# EAGLE design untitled (EAGLE 7.7.0)
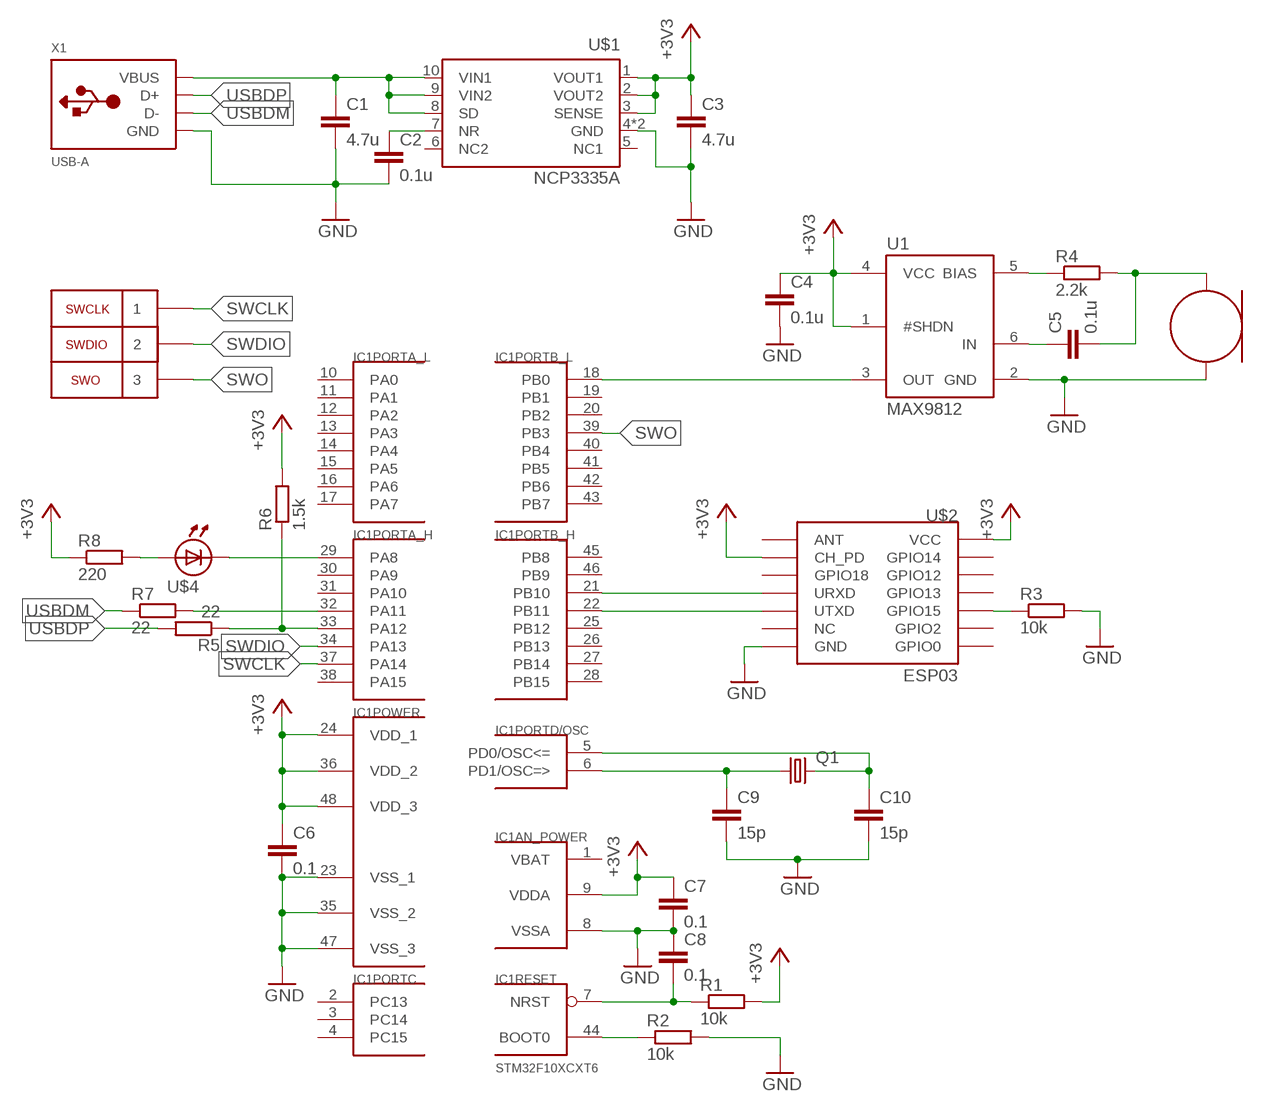
[diagram p0: schematic, sheet 1]

## Parts
C1  4.7u  C-EUC0805  [C0805]
C2  0.1u  C-EUC0805  [C0805]
C3  4.7u  C-EUC0805  [C0805]
C4  0.1u  C-EUC0603  [C0603]
C5  0.1u  C-EUC0603  [C0603]
C6  0.1  C-EUC0805  [C0805]
C7  0.1  C-EUC0805  [C0805]
C8  0.1  C-EUC0805  [C0805]
C9  15p  C-EUC0603  [C0603]
C10  15p  C-EUC0603  [C0603]
IC1  STM32F10XCXT6  [TQFP48]
Q1  CRYSTAL  [DSX321G]
R1  10k  R-EU_R0805  [R0805]
R2  10k  R-EU_R0805  [R0805]
R3  10k  R-EU_R0805  [R0805]
R4  2.2k  R-EU_R0603  [R0603]
R5  22  R-EU_R0805  [R0805]
R6  1.5k  R-EU_R0805  [R0805]
R7  22  R-EU_R0805  [R0805]
R8  220  R-EU_R0805  [R0805]
U1  MAX9812  [SC-70-6]
U$1  NCP3335A  [DFN10-3X3]
U$2  ESP03  [ESP03]
U$3  MIC  [MIC]
U$4  LED1206  [R1206]
U$5  PLS2-3  [PLS2-3]
X1  USB-A  [MOLEX_480371000]

## Nets
+3V3: C3.1 C4.1 C6.1 C7.1 IC1.9(AN_POWER:VDDA) IC1.24(POWER:VDD_1) IC1.36(POWER:VDD_2) IC1.48(POWER:VDD_3) R1.2 R6.2 R8.1 U1.1(#SHDN) U1.4(VCC) U$1.1(VOUT1) U$1.2(VOUT2) U$1.3(SENSE) U$2.CH_PD U$2.VCC
GND: C1.2 C2.2 C3.2 C4.2 C6.2 C7.2 C8.1 C9.2 C10.2 IC1.8(AN_POWER:VSSA) IC1.23(POWER:VSS_1) IC1.35(POWER:VSS_2) IC1.47(POWER:VSS_3) R2.2 R3.2 U1.2(GND) U$1.4(GND) U$1.EXP(GND) U$2.GND U$3.P$2 X1.4(GND)
N$1: C1.1 U$1.8(SD) U$1.9(VIN2) U$1.10(VIN1) X1.1(VBUS)
N$2: C2.1 U$1.7(NR)
N$3: C8.2 IC1.7(RESET:NRST) R1.1
N$4: IC1.44(RESET:BOOT0) R2.1
N$5: IC1.21(PORTB_H:PB10) U$2.URXD
N$6: IC1.22(PORTB_H:PB11) U$2.UTXD
N$7: R3.1 U$2.GPIO15
N$8: IC1.18(PORTB_L:PB0) U1.3(OUT)
N$9: R4.1 U1.5(BIAS)
N$10: C5.1 U1.6(IN)
N$11: C5.2 R4.2 U$3.P$1
N$12: IC1.33(PORTA_H:PA12) R5.1 R6.1
N$13: IC1.32(PORTA_H:PA11) R7.2
N$14: C9.1 IC1.6(PORTD/OSC:PD1/OSC=>) Q1.P$1
N$15: C10.1 IC1.5(PORTD/OSC:PD0/OSC<=) Q1.P$3
N$16: R8.2 U$4.1
N$17: IC1.29(PORTA_H:PA8) U$4.2
SWCLK: IC1.37(PORTA_H:PA14) U$5.P$1
SWDIO: IC1.34(PORTA_H:PA13) U$5.P$2
SWO: IC1.39(PORTB_L:PB3) U$5.P$3
USBDM: R7.1 X1.2(D-)
USBDP: R5.2 X1.3(D+)
Unconnected: IC1.2(PORTC:PC13) IC1.3(PORTC:PC14) IC1.4(PORTC:PC15) IC1.10(PORTA_L:PA0) IC1.11(PORTA_L:PA1) IC1.12(PORTA_L:PA2) IC1.13(PORTA_L:PA3) IC1.14(PORTA_L:PA4) IC1.15(PORTA_L:PA5) IC1.16(PORTA_L:PA6) IC1.17(PORTA_L:PA7) IC1.19(PORTB_L:PB1) IC1.20(PORTB_L:PB2) IC1.25(PORTB_H:PB12) IC1.26(PORTB_H:PB13) IC1.27(PORTB_H:PB14) IC1.28(PORTB_H:PB15) IC1.30(PORTA_H:PA9) IC1.31(PORTA_H:PA10) IC1.38(PORTA_H:PA15) IC1.40(PORTB_L:PB4) IC1.41(PORTB_L:PB5) IC1.42(PORTB_L:PB6) IC1.43(PORTB_L:PB7) IC1.45(PORTB_H:PB8) IC1.46(PORTB_H:PB9) U$1.5(NC1) U$1.6(NC2) U$2.ANT U$2.GPIO0 U$2.GPIO2 U$2.GPIO12 U$2.GPIO13 U$2.GPIO14 U$2.GPIO18 U$2.NC

## Power pins joined to a net without a drawn wire
VBAT: IC1.1(AN_POWER:VBAT)

## Library data of the parts
C1-C10 = rcl:C-EU: CAPACITOR, European symbol
IC1 = stm32:STM32F10XCXT6: ST STM32F101/103 48pin LQFP
Q1 = untitled:CRYSTAL: CRYSTAL
R1-R8 = rcl:R-EU_: RESISTOR, European symbol
U1 = untitled:MAX9812: Maxim's MAX9812 Tiny, Low-Cost, Single/Dual-Input, Fixed-Gain Microphone Amplifiers with Integrated Bias Description: The MAX9812/MAX9813 are single/dual-input, 20dB fixed-gain microphone amplifiers. They offer tiny packaging and a low-noise, integrated microphone bias, making them ideal for portable audio applications such as notebook computers, cell phones, and PDAs. These amplifiers feature a 500kHz bandwidth, Rail-to-Rail® outputs, an industry-leading 100dB power-supply rejection ratio, and a very low 0.015% THD+N. Power-saving features include very low 230?A supply current and a total shutdown mode that cuts the combined supply and BIAS currents to only 100nA. The MAX9812 is a single amplifier in a 6-pin SC70 package (2mm x 2.1mm) and the MAX9813 is a dualinput amplifier available in an 8-pin SOT23 (3mm x 3mm) package. The MAX9813 has two inputs allowing two microphones to be multiplexed to a single output. The MAX9812/MAX9813 are offered in two grades. The MAX9812L/MAX9813L are optimized for 3.3V supply operation (2.7V to 3.6V). The MAX9812H/MAX9813H are PC2001 compliant and are optimized for 5V operation (4.5V to 5.5V). Both devices are specified over the -40°C to +85°C extended operating temperature range. Features: PC2001 Compliant 100dB at 217Hz Power-Supply Rejection Ratio Very Low 230?A Quiescent Current Low 0.015% THD+N Available in Two Versions: - MAX9812L/MAX9813L?2.7V to 3.6V - MAX9812H/MAX9813H?4.5V to 5.5V Internal Low-Noise Microphone Bias Supply - 2.3V for MAX9812L/MAX9813L - 4.0V for MAX9812H/MAX9813H 100nA Low-Power Shutdown Mode Rail-to-Rail Outputs 20dB Fixed Gain Available in Tiny 6-Pin SC70 (2mm x 2.1mm) and 8-Pin SOT23 (3mm x 3mm) Packages Extended Temperature Range -40°C to +85°C Applications: Notebook Computers PDAs Smart Phones Car Kit Adapters Digital Cameras Video Tape Recorders Please send any comments to: messi@users.sourceforge.net
U$1 = untitled:NCP3335A
U$2 = untitled:ESP03: ESP8266 Wifi module 03; DIMENSIONS: 17.3 x 12.1 mm; PINS: 14; PITCH: 0.078" / 2 mm
U$3 = untitled:MIC
U$4 = untitled:LED1206
U$5 = untitled:PLS2-3
X1 = untitled:USB-A: USB type A 'plug' Used for things that can directly connect to a USB port, say USB key

## Board
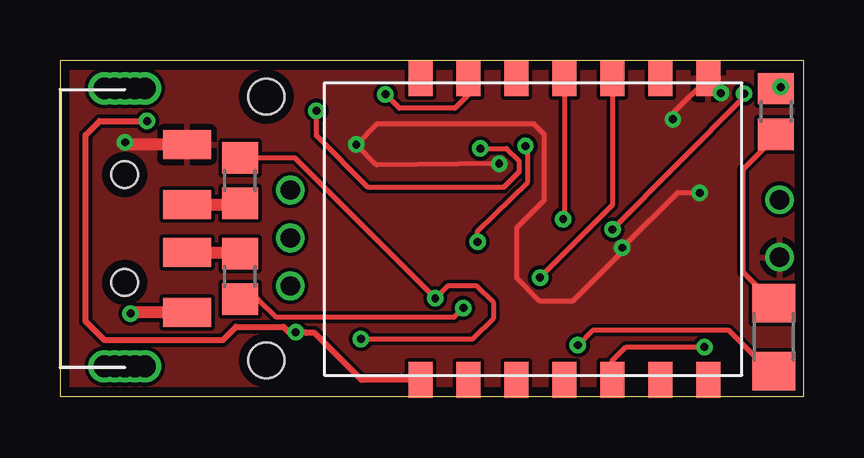
[diagram p1: board, top side]
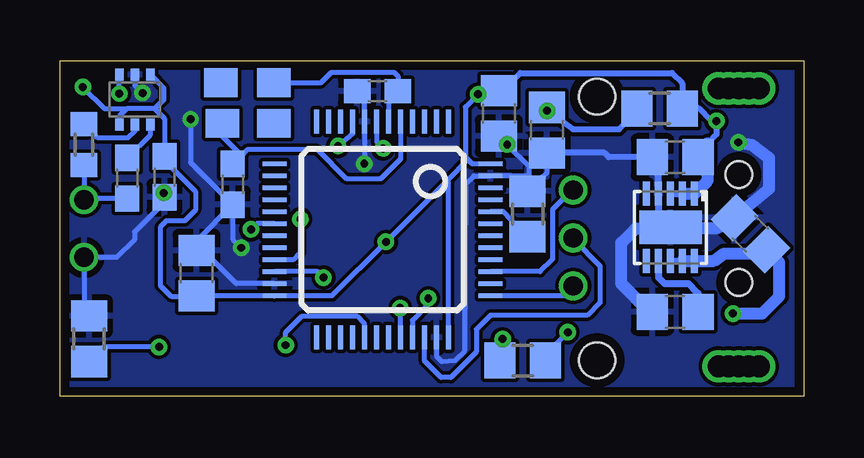
[diagram p2: board, bottom side, seen from below]

Size 31 x 14 mm. Coordinates in mm from the lower left corner, seen from the top.
Outline: 0,0 31,0 31,14 0,14 0,0
Copper layers (1*16): Top 0.0356mm / dielectric 1.5011mm / Bottom 0.0356mm
Design rules "oshpark-2layer": minimum track width 6mil, minimum drill 13mil, track to track 6mil, track to pad 6mil, pad to pad 6mil, via to via 6mil, smd to smd 6mil, copper to edge 15mil, drill to drill 6mil, minimum pad ring 7mil, minimum via ring 7mil, stop-mask expansion 2.5mil, vias tented up to drill 0mil, thermal gap 10mil
Holes 1.5 mm at 8.6,1.5 8.6,12.5

### Footprints (pad centres in the part's own frame; a part is rotated, then mirrored left to right if it is on the bottom)
C0805 = smd 1.3 x 1.5: 1 -0.95,0; 2 0.95,0
C0603 = smd 1.1 x 1: 1 -0.85,0; 2 0.85,0
TQFP48 = smd 0.2 x 1: 1 -2.75,-4.5; 2 -2.25,-4.5; 3 -1.75,-4.5; 4 -1.25,-4.5; 5 -0.75,-4.5; 6 -0.25,-4.5; 7 0.25,-4.5; 8 0.75,-4.5; 9 1.25,-4.5; 10 1.75,-4.5; 11 2.25,-4.5; 12 2.75,-4.5; 25 2.75,4.5; 26 2.25,4.5; 27 1.75,4.5; 28 1.25,4.5; 29 0.75,4.5; 30 0.25,4.5; 31 -0.25,4.5; 32 -0.75,4.5; 33 -1.25,4.5; 34 -1.75,4.5; 35 -2.25,4.5; 36 -2.75,4.5 | smd 1 x 0.2: 13 4.5,-2.75; 14 4.5,-2.25; 15 4.5,-1.75; 16 4.5,-1.25; 17 4.5,-0.75; 18 4.5,-0.25; 19 4.5,0.25; 20 4.5,0.75; 21 4.5,1.25; 22 4.5,1.75; 23 4.5,2.25; 24 4.5,2.75; 37 -4.5,2.75; 38 -4.5,2.25; 39 -4.5,1.75; 40 -4.5,1.25; 41 -4.5,0.75; 42 -4.5,0.25; 43 -4.5,-0.25; 44 -4.5,-0.75; 45 -4.5,-1.25; 46 -4.5,-1.75; 47 -4.5,-2.25; 48 -4.5,-2.75
DSX321G = smd 1.4 x 1.2: P$1 -1.1,-0.85; P$2 1.1,-0.85; P$3 1.05,0.85; P$4 -1.1,0.85
R0805 = smd 1.3 x 1.5: 1 -0.95,0; 2 0.95,0
R0603 = smd 1 x 1.1: 1 -0.85,0; 2 0.85,0
SC-70-6 = smd 0.35 x 0.5: 1 -0.65,-1.05; 2 0,-1.05; 3 0.65,-1.05; 4 0.65,1.05; 5 0,1.05; 6 -0.65,1.05
DFN10-3X3 = smd 1 x 0.3: 1 -1.4,1; 2 -1.4,0.5; 3 -1.4,0; 4 -1.4,-0.5; 5 -1.4,-1; 6 1.4,-1; 7 1.4,-0.5; 8 1.4,0; 9 1.4,0.5; 10 1.4,1 | smd 1.4 x 2.6: EXP 0,0
ESP03 = smd 1.5 x 1: ANT 7.4,4.8; CH_PD 7.4,2.8; GND 7.4,-7.2; GPIO0 -5.2,-7.2; GPIO2 -5.2,-5.2; GPIO12 -5.2,0.8; GPIO13 -5.2,-1.2; GPIO14 -5.2,2.8; GPIO15 -5.2,-3.2; GPIO18 7.4,0.8; NC 7.4,-5.2; URXD 7.4,-1.2; UTXD 7.4,-3.2; VCC -5.2,4.8
MIC = drill 0.8: P$1 1.2,0; P$2 -1.2,0
R1206 = smd 1.6 x 1.803: 1 -1.422,0; 2 1.422,0
PLS2-3 = drill 0.8: P$1 -2,0; P$2 0,0; P$3 2,0
MOLEX_480371000 = smd 1.2 x 2: 1 3.5,2.6; 2 1,2.6; 3 -1,2.6; 4 -3.5,2.6 | drill 0.9: P$1 -5.85,0; P$2 -5.85,-0.84; P$3 -5.85,-0.42; P$4 -5.85,0.42; P$5 -5.85,0.84; P$6 5.75,0; P$7 5.75,-0.84; P$8 5.75,-0.42; P$9 5.75,0.42; P$10 5.75,0.84 | hole 1.1: -2.25,0; 2.25,0

### Placement (x,y rotation side)
C1  2.21,6.78 135 bottom
C2  5.35,3.52 180 bottom
C3  5.35,9.97 180 bottom
C4  26.64,9.15 270 bottom
C5  28.2,9.1 270 bottom
C6  25.3,5.14 90 bottom
C7  12.7,11.8 270 bottom
C8  10.7,11.1 90 bottom
C9  17.76,12.73 180 bottom
C10  23.79,8.84 270 bottom
IC1  17.55,6.95 180 bottom
Q1  23.19,12.24 180 bottom
R1  6,12 0 bottom
R2  11.51,7.6 90 bottom
R3  29.79,2.4 90 bottom
R4  30,10.5 270 bottom
R5  7.5,9 270 top
R6  11.7,1.49 0 bottom
R7  7.5,5 270 top
R8  29.85,11.88 270 top
U1  27.87,12.37 180 bottom
U$1  5.55,7.05 270 bottom
U$2  19.83,5.88 90 top
U$3  30,7 90 top
U$4  29.76,2.47 270 top
U$5  9.6,6.6 90 top
X1  2.7,7 270 top

### Tracks (layer width: path | path; a pad name or v marks a point on that pad's centre or on a via)
+3V3  (via drill 0.33, 0.33 pad 0.69)
  Top 0.203: v17.41,6.44 17.41,6.9 19.51,8.94 19.51,10.29 v19.41,10.44 | R8.1 29.93,12.9 v30.05,12.9 | U$2.CH_PD 17.03,12.59 16.46,12.01 14.15,12.01 v13.57,12.6
  Top 0.254: U$2.VCC 12.58,0.68 10.62,2.64 10.26,2.64 10.24,2.67 v9.83,2.67 9.55,2.67 9.32,2.9 7.34,2.9 6.78,2.34 1.85,2.34 1.07,3.12 1.07,10.9 1.65,11.48 v3.63,11.48
  Bottom 0.203: v13.57,12.6 13.41,12.75 C7.1 12.86,12.6 v13.57,12.6 | v13.57,12.6 14.1,12.06 14.1,9.98 13.98,9.87 | 13.98,9.87 13.82,9.7 IC1.48 | IC1.36 14.8,9.05 | 14.8,9.05 13.98,9.87 | 14.8,9.05 v17.41,6.44 19.65,4.2 IC1.24 22.06,4.19 C6.1 25.32,4.17 26.36,4.17 26.82,4.62 26.82,7.06 26.57,7.32 25.81,7.32 25.35,7.77 25.35,8.53 26.64,9.83 C4.1 26.64,11.58 27.05,11.99 | IC1.9 18.8,10.94 v19.41,10.44 | R6.2 10.76,1.79 v9.83,2.67 | U1.1 27.23,13.41 26.67,12.85 26.67,12.37 27.05,11.99 | 27.05,11.99 28.22,11.99 | 28.22,11.99 28.52,11.68 U1.4 | v30.05,12.9 29.13,11.99 28.22,11.99
  Bottom 0.254: 4,10.55 3.63,10.92 v3.63,11.48 3.83,11.48 4.37,12.01 5.04,12.01 R1.2 5.05,13.06 5.49,13.49 11.81,13.49 12.55,12.75 C7.1
  Bottom 0.3: U$1.3 U$1.2
  Bottom 0.5: U$1.2 U$1.1 4,9 4,10.27 | 4,10.27 C3.1 | 4,10.27 4,10.55
GND  (via drill 0.33)
  Top 0.203: v18.31,9.7 13.21,9.65 v12.36,10.51 13.2,11.35 19.76,11.35 20.19,10.92 20.19,8.18 19.05,7.04 19.05,4.93 20.02,3.96 21.36,3.96 23.44,6.04 v23.44,6.2 25.73,8.48 v26.67,8.48 | v25.55,11.56 25.55,11.8 U$2.GND 27.56,12.75 v27.56,12.65
  Top 0.5: X1.4 2.78,10.5 v2.72,10.59
  Bottom 0.203: IC1.35 15.3,1.66 15.09,1.45 14.53,1.5 14.12,1.91 14.07,8.87 13.74,9.2 IC1.47 11.48,9.2 11.46,9.22 | C9.2 18.3,12.43 IC1.8 18.3,9.66 v18.31,9.7 | 26.33,7.99 C4.2 | C8.1 10.7,9.31 R2.2 11.46,9.22 | C7.2 v12.36,10.51 11.46,9.61 11.46,9.22 | IC1.23 23.65,4.7 25.03,6.09 C6.2 25.3,6.48 C10.2 | R3.2 30,3.56 U$3.P$2 28.63,5.79 27.89,6.53 27.89,6.86 26.64,8.11 C4.2 | C10.2 23.79,6.55 v23.44,6.2 | v25.55,11.56 25.55,9.75 C10.2 | U1.2 27.88,12.96 v27.56,12.65 | C4.2 26.64,8.46 v26.67,8.48
  Bottom 0.254: C3.2 8.12,9.97 8.31,10.16 C8.1
  Bottom 0.3: C3.2 6.05,10.42 U$1.4 6.05,7.55 U$1.EXP
  Bottom 0.5: C2.2 6.42,3.52 7.6,4.7 7.6,6.4 7,7 5.6,7 U$1.EXP 5.5,7 3.6,7 3.15,7.45 C1.2 1.45,8.65 1.45,9.96 2.16,10.49 v2.72,10.59
  pour Top: 0,14 31,14 31,0 0,0
  pour Bottom: 0,14 31,14 31,0 0,0
N$1  (via drill 0.33)
  Top 0.5: X1.1 2.99,3.5 v2.95,3.45
  Bottom 0.2: 5,6 5.05,5.95 U$1.9 U$1.10
  Bottom 0.3: U$1.8 U$1.9
  Bottom 0.5: U$1.9 3.75,5.65 3.32,5.95 1.56,5.95 C1.1 1.02,5.59 1.02,4.17 1.73,3.45 v2.95,3.45
N$2
  Bottom 0.3: C2.1 4.4,4.3 4.8,4.7 5.8,4.7 6.05,4.95 U$1.7
N$3  (via drill 0.33)
  Top 0.203: v17.53,10.34 18.62,10.34 19.13,9.83 19.13,9.35 18.49,8.71 12.85,8.71 10.69,10.87 v10.69,11.91
  Bottom 0.203: 10.65,12 C8.2 v10.69,11.91 | IC1.7 17.8,10.61 v17.53,10.34
  Bottom 0.254: R1.1 6.95,11.92 7.7,11.12 9.6,11.12 v10.69,11.91
N$4
  Bottom 0.203: R2.1 12.5,7.7 IC1.44
N$5  (via drill 0.33)
  Top 0.203: U$2.URXD 21.03,7.44 v20.98,7.39
  Bottom 0.203: v20.98,7.39 20.98,5.99 21.29,5.69 IC1.21
N$6  (via drill 0.33)
  Top 0.203: U$2.UTXD 23.03,7.97 v20.02,4.95
  Bottom 0.203: v20.02,4.95 20.26,5.2 IC1.22
N$7  (via drill 0.33)
  Top 0.203: U$2.GPIO15 23.03,1.49 23.6,2.06 v26.87,2.06
  Bottom 0.203: v26.87,2.06 29.18,2.06 R3.1
N$8  (via drill 0.33)
  Top 0.203: v23.04,6.96 28.52,12.5 v28.52,12.62
  Bottom 0.203: IC1.18 22.8,7.2 v23.04,6.96 | v28.52,12.62 U1.3
N$9
  Bottom 0.203: U1.5 27.88,11.06 28.17,10.77 29.42,10.77 R4.1
N$10
  Bottom 0.203: C5.1 27.23,10.93 U1.6
N$11
  Bottom 0.203: R4.2 U$3.P$1 29.95,8.25 C5.2
N$12  (via drill 0.33)
  Top 0.203: R5.1 9.79,9.95 v15.65,4.09 16.15,4.6 17.37,4.6 18.09,3.89 18.09,3.28 17.2,2.39 v12.55,2.39
  Bottom 0.203: v15.65,4.09 15.65,3.83 16.31,3.17 IC1.33 | R6.1 12.65,2.28 v12.55,2.39
N$13  (via drill 0.33)
  Top 0.203: R7.2 8.27,4.05 9.02,3.3 16.43,3.3 v16.82,3.68
  Bottom 0.203: v16.82,3.68 16.82,2.46 IC1.32
N$14
  Bottom 0.203: 17.3,12.64 IC1.6 | Q1.P$1 20.11,13.09 19.68,13.51 17.07,13.51 16.91,13.35 C9.1
  Bottom 0.254: C9.1 17.2,12.73 17.3,12.64
N$15
  Bottom 0.203: IC1.5 16.8,9.89 17.63,9.07 19.05,9.07 20.27,10.29 23.2,10.29 23.44,10.05 | 23.44,10.05 C10.1 | Q1.P$3 24.24,10.85 23.44,10.05
N$16
  Top 0.203: R8.2 29.85,10.83 28.47,9.45 28.47,5.18 U$4.1
N$17  (via drill 0.33)
  Top 0.203: U$4.2 29.59,1.05 27.89,2.74 22.2,2.74 v21.59,2.13
  Bottom 0.203: v21.59,2.13 21.59,2.67 20.9,3.35 18.62,3.35 18.31,3.05 18.31,2.46 IC1.29
SWCLK
  Bottom 0.203: IC1.37 10,4.2 U$5.P$1
SWDIO
  Bottom 0.203: U$5.P$2 9.6,6.55 8.48,5.44 8.48,3.91 9.02,3.38 13.06,3.38 13.64,2.79 13.64,1.85 14.71,0.79 15.11,0.79 15.8,1.47 IC1.34
SWO
  Bottom 0.203: U$5.P$3 9.66,8.6 10.46,7.8 10.46,5.71 10.98,5.2 IC1.39
USBDM
  Top 0.5: X1.2 7.45,6 R7.1
USBDP
  Top 0.5: X1.3 7.45,8 R5.2